# Altium schematic sheet 501_GridPos5.SchDoc: Grid Position 5 / USB 4
size A2; Organization: Greenfield Tech Solutions; Address1: Molendreef 33; Address2: Ossendrecht; Address3: 4641CS; Address4: The Netherlands; SheetNumber: 6; SheetTotal: 9
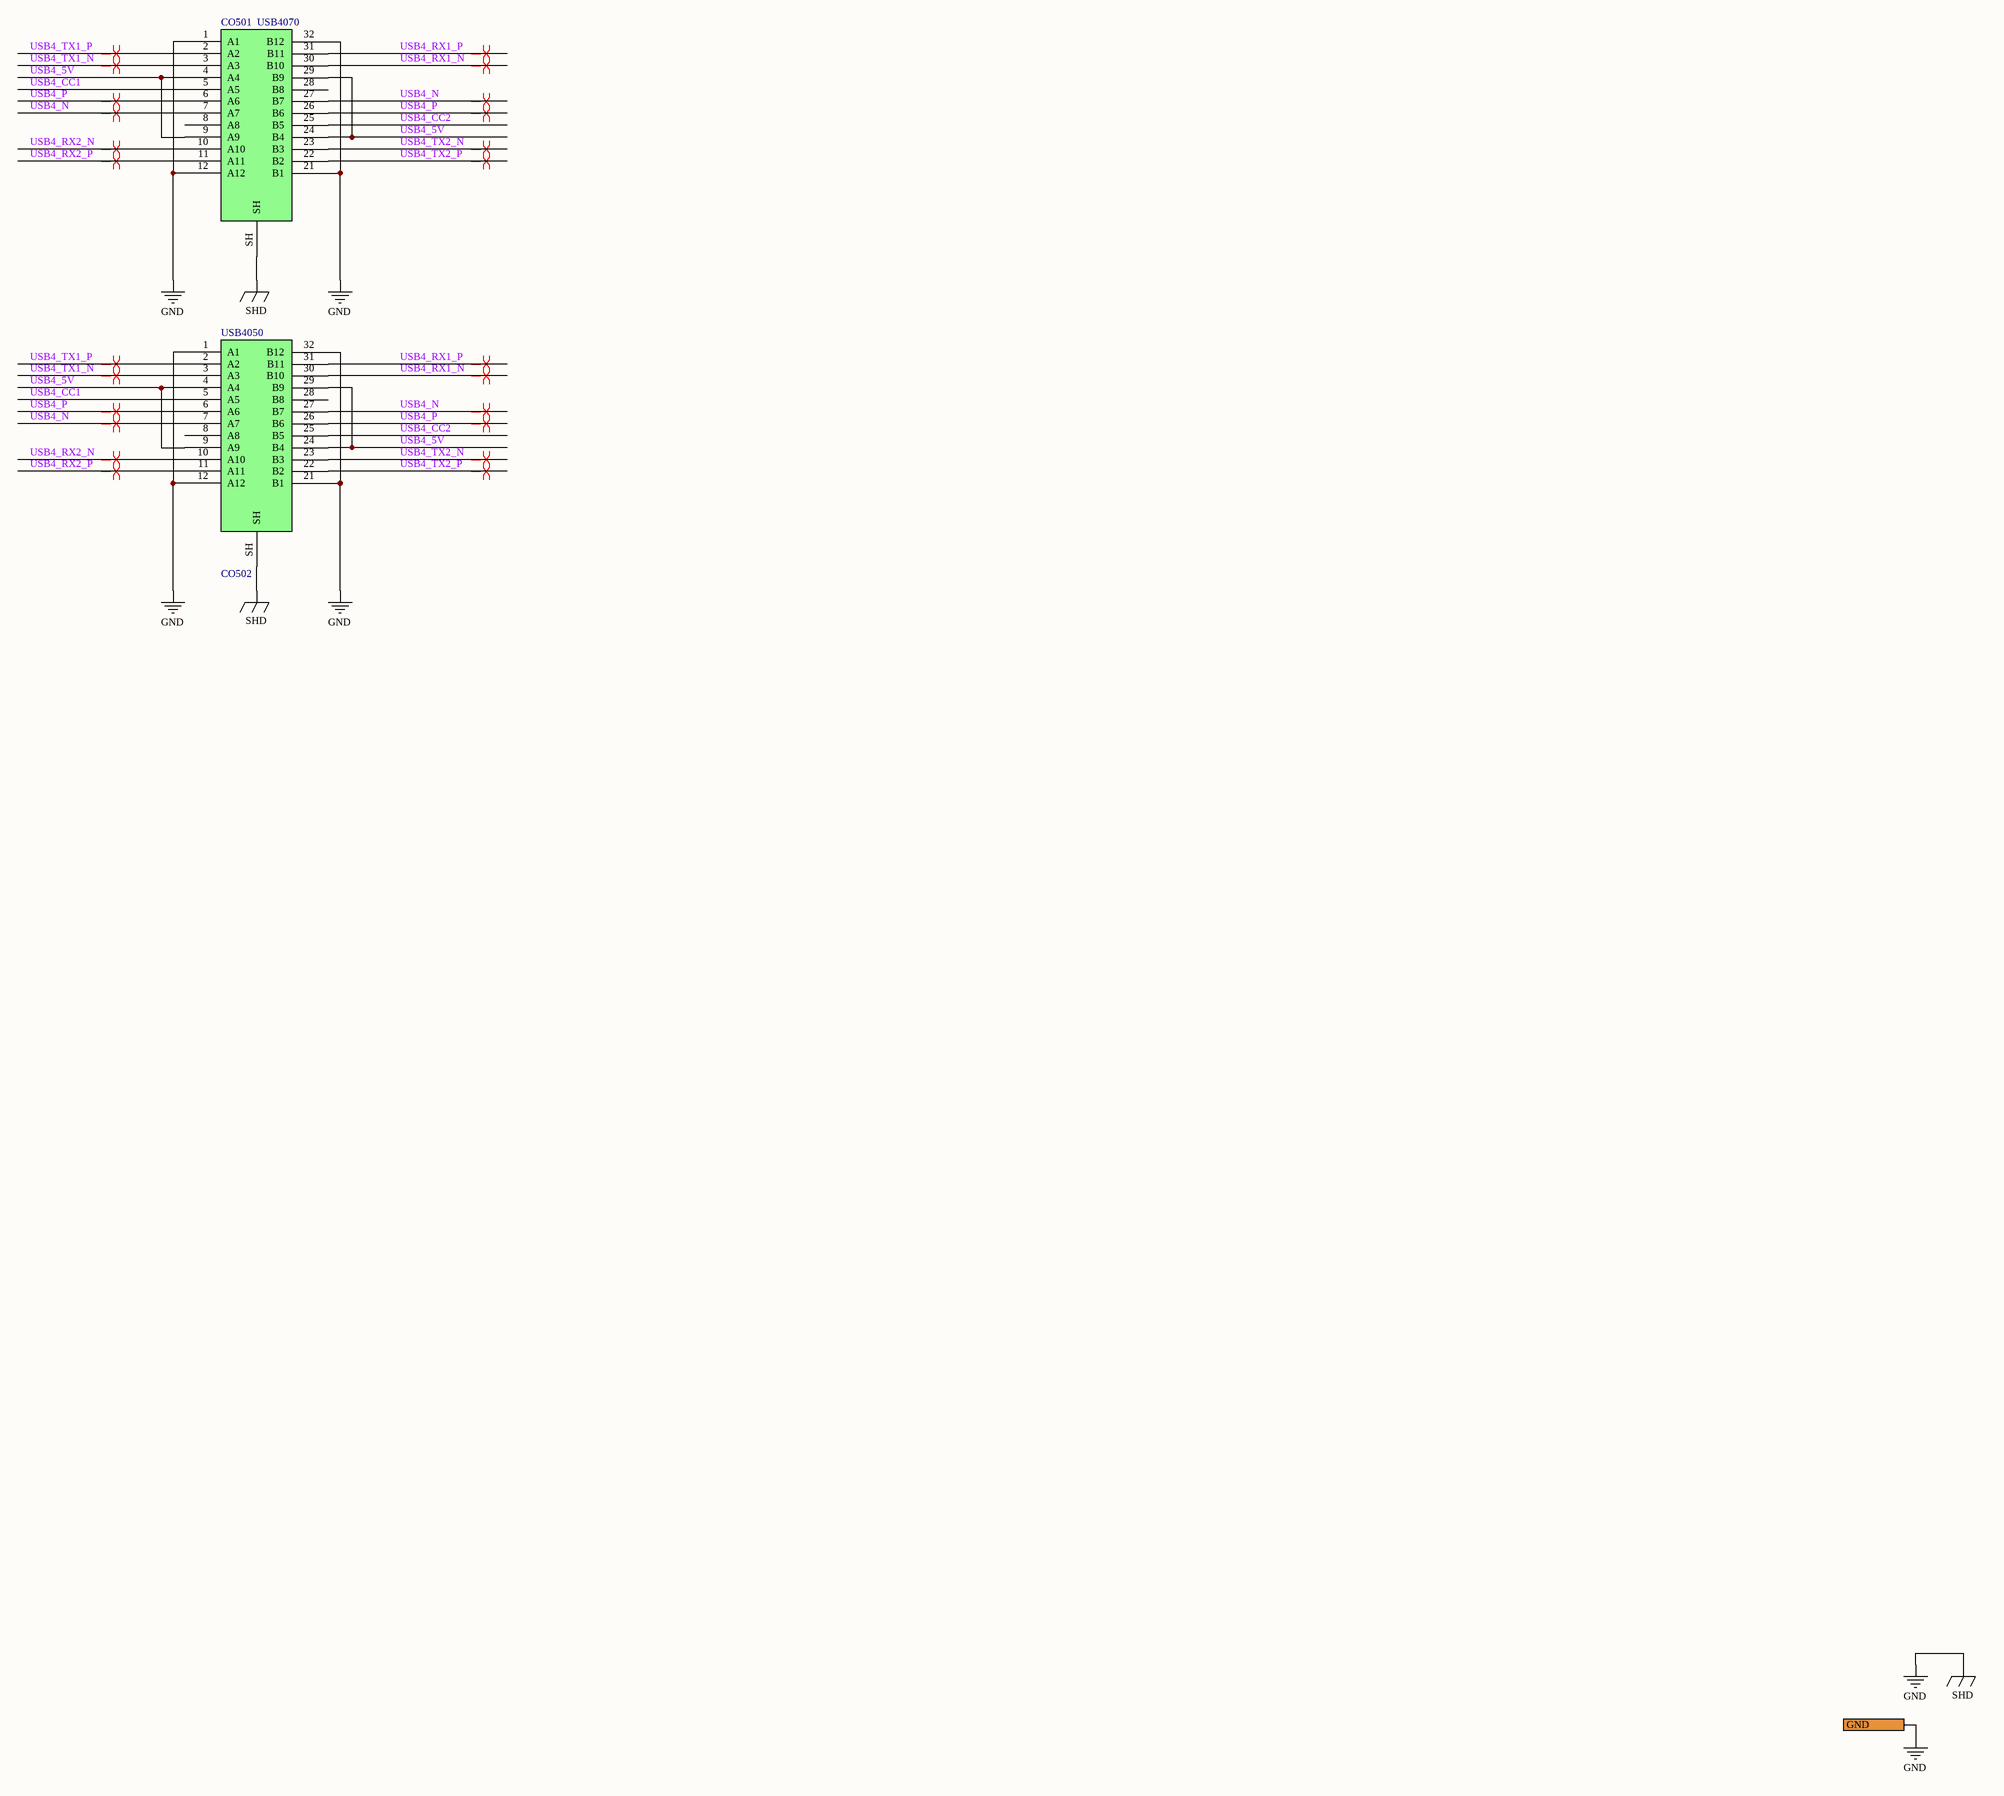
[diagram p0: 501_GridPos5.SchDoc]

## Parts
CO501  USB4070  [USB4070-30-C]
CO502  USB4050  [USB4050-30-A]

## Ports
GND

## Nets
GND: CO501.1(A1) CO501.12(A12) CO501.21(B1) CO501.32(B12) CO501.SH CO502.1(A1) CO502.12(A12) CO502.21(B1) CO502.32(B12) CO502.SH ; port GND  [also labelled SHD]
USB4_5V: CO501.4(A4) CO501.9(A9) CO501.24(B4) CO501.29(B9) CO502.4(A4) CO502.9(A9) CO502.24(B4) CO502.29(B9)
USB4_CC1: CO501.5(A5) CO502.5(A5)
USB4_CC2: CO501.25(B5) CO502.25(B5)
USB4_N: CO501.7(A7) CO501.27(B7) CO502.7(A7) CO502.27(B7)
USB4_P: CO501.6(A6) CO501.26(B6) CO502.6(A6) CO502.26(B6)
USB4_RX1_N: CO501.30(B10) CO502.30(B10)
USB4_RX1_P: CO501.31(B11) CO502.31(B11)
USB4_RX2_N: CO501.10(A10) CO502.10(A10)
USB4_RX2_P: CO501.11(A11) CO502.11(A11)
USB4_TX1_N: CO501.3(A3) CO502.3(A3)
USB4_TX1_P: CO501.2(A2) CO502.2(A2)
USB4_TX2_N: CO501.23(B3) CO502.23(B3)
USB4_TX2_P: CO501.22(B2) CO502.22(B2)

Not connected (* = marked no-connect by the designer): CO501 8(A8) 28(B8); CO502 8(A8) 28(B8)

## Layout directives
differential pair; differential pair class USB3: USB4_N, USB4_P, USB4_RX1_N, USB4_RX1_P, USB4_RX2_N, USB4_RX2_P, USB4_TX1_N, USB4_TX1_P, USB4_TX2_N, USB4_TX2_P

## Notes on the sheet
- Title
- Size:
- Date:
- File:
- A2
- Number:
- Time:
- Revision:
- Sheet
- of

## Library data of the parts
CO501 = CO0021: USB4070-30-C; Part Number: CO0021; ID: 16; RefVal: USB4070; ManfactPart: USB4070-30-C
CO502 = CO0039: USB C connector Receptacle Horizontal; Part Number: CO0039; ID: 39; RefVal: USB4050; ManfactPart: USB4050-30-A